# EAGLE design raspberry-pi-interface-board (EAGLE 6.3)
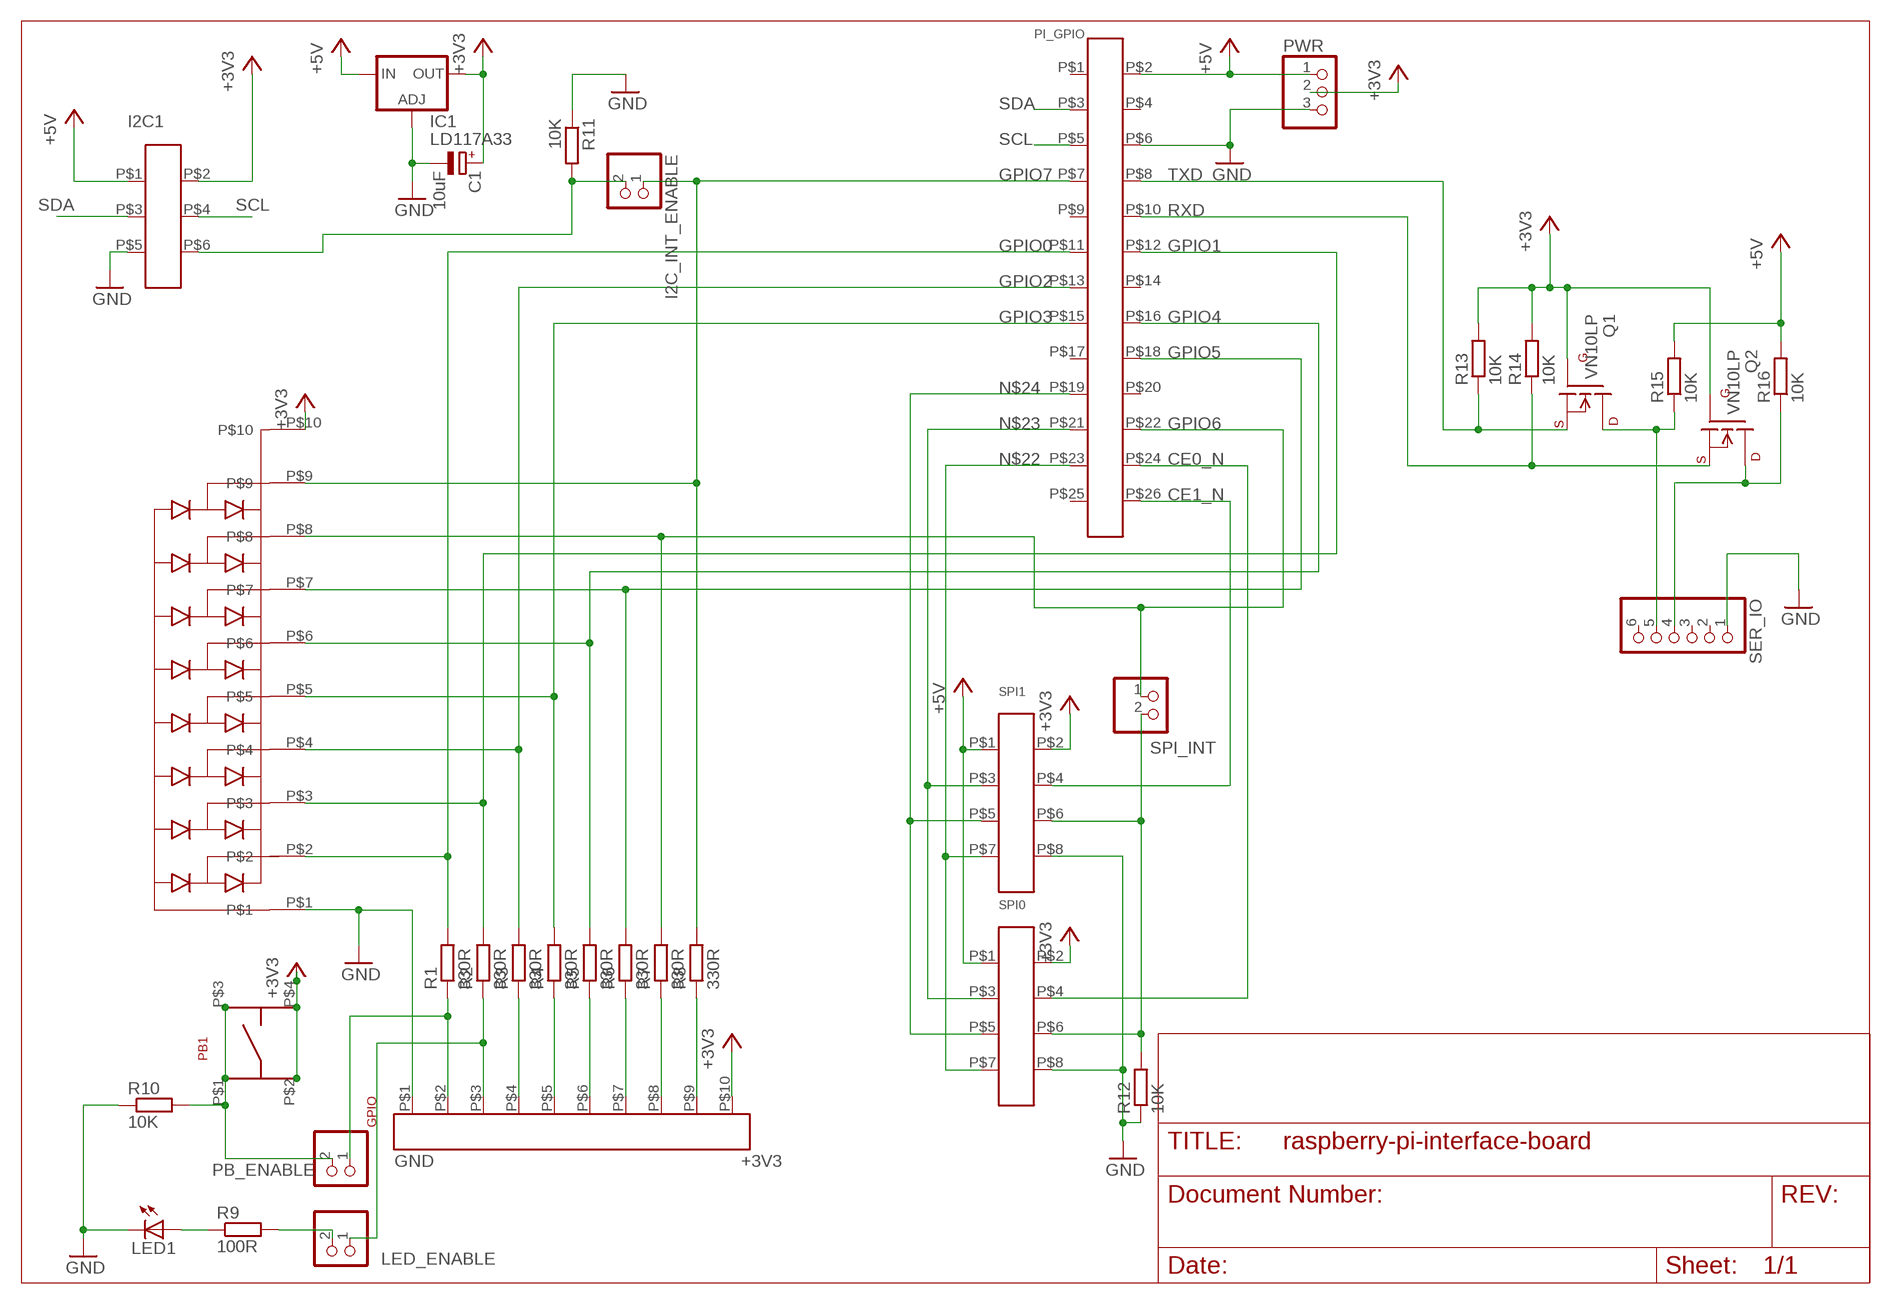
[diagram p0: schematic, sheet 1]

## Parts
C1  10uF  CPOL-EUE2.5-7  [E2,5-7]
GPIO  APM-10W-SOCKET  [AMP-10W-SOCKET]
I2C1  IC2_0  IDC-6W  [IDC-6W]
I2C_INT_ENABLE  PINHD-1X2  [1X02]
IC1  LD117A33  [TO220S]
LED1  LED3MM  [LED3MM]
LED_ENABLE  PINHD-1X2  [1X02]
PB1  TYCO-PUSHBUTTON  [TYCO-PUSHBUTTON]
PB_ENABLE  PINHD-1X2  [1X02]
PI_GPIO  IDC-26W  [IDC-26W]
PWR  PINHD-1X3  [1X03]
Q1  VN10LP  [TO92]
Q2  VN10LP  [TO92]
R1  330R  R-EU_0204/7  [0204/7]
R2  330R  R-EU_0204/7  [0204/7]
R3  330R  R-EU_0204/7  [0204/7]
R4  330R  R-EU_0204/7  [0204/7]
R5  330R  R-EU_0204/7  [0204/7]
R6  330R  R-EU_0204/7  [0204/7]
R7  330R  R-EU_0204/7  [0204/7]
R8  330R  R-EU_0204/7  [0204/7]
R9  100R  R-EU_0207/10  [0207/10]
R10  10K  R-EU_0207/10  [0207/10]
R11  10K  R-EU_0207/10  [0207/10]
R12  10K  R-EU_0207/10  [0207/10]
R13  10K  R-EU_0207/10  [0207/10]
R14  10K  R-EU_0207/10  [0207/10]
R15  10K  R-EU_0207/10  [0207/10]
R16  10K  R-EU_0207/10  [0207/10]
SER_IO  PINHD-1X6  [1X06]
SPI0  IDC-8W  [IDC-8W]
SPI1  IDC-8W  [IDC-8W]
SPI_INT  PINHD-1X2  [1X02]
U$2  D10-5A  [D10-5A]

## Nets
+3V3 [power]: C1.+ GPIO.P$10 I2C1.P$2 IC1.2(OUT) PB1.P$2 PB1.P$4 PWR.2 Q1.2(G) Q2.2(G) R13.2 R14.2 SPI0.P$2 SPI1.P$2 U$2.P$10
+5V [power]: I2C1.P$1 IC1.3(IN) PI_GPIO.P$2 PWR.1 R15.2 R16.2 SPI0.P$1 SPI1.P$1
CE0_N: PI_GPIO.P$24 SPI0.P$4
CE1_N: PI_GPIO.P$26 SPI1.P$4
GND [power]: C1.- GPIO.P$1 I2C1.P$5 IC1.1(ADJ) LED1.K(C) PI_GPIO.P$6 PWR.3 R10.1 R11.1 R12.1 SER_IO.1 SPI0.P$8 SPI1.P$8 U$2.P$1
GPIO0: PI_GPIO.P$11 R1.2 U$2.P$2
GPIO1: PI_GPIO.P$12 R2.2 U$2.P$3
GPIO2: PI_GPIO.P$13 R3.2 U$2.P$4
GPIO3: PI_GPIO.P$15 R4.2 U$2.P$5
GPIO4: PI_GPIO.P$16 R5.2 U$2.P$6
GPIO5: PI_GPIO.P$18 R6.2 U$2.P$7
GPIO6: PI_GPIO.P$22 R7.2 SPI_INT.1 U$2.P$8
GPIO7: I2C_INT_ENABLE.1 PI_GPIO.P$7 R8.2 U$2.P$9
N$1: PB1.P$1 PB1.P$3 PB_ENABLE.2 R10.2
N$2: Q2.1(D) R16.1 SER_IO.4
N$3: GPIO.P$2 PB_ENABLE.1 R1.1
N$4: GPIO.P$3 LED_ENABLE.1 R2.1
N$5: GPIO.P$4 R3.1
N$6: GPIO.P$5 R4.1
N$7: GPIO.P$6 R5.1
N$8: GPIO.P$7 R6.1
N$9: GPIO.P$8 R7.1
N$10: GPIO.P$9 R8.1
N$12: Q1.1(D) R15.1 SER_IO.5
N$14: LED1.A R9.1
N$15: LED_ENABLE.2 R9.2
N$21: I2C1.P$6 I2C_INT_ENABLE.2 R11.2
N$22: PI_GPIO.P$23 SPI0.P$7 SPI1.P$7
N$23: PI_GPIO.P$21 SPI0.P$3 SPI1.P$3
N$24: PI_GPIO.P$19 SPI0.P$5 SPI1.P$5
N$28: R12.2 SPI0.P$6 SPI1.P$6 SPI_INT.2
RXD: PI_GPIO.P$10 Q2.3(S) R14.1
SCL: I2C1.P$4 PI_GPIO.P$5
SDA: I2C1.P$3 PI_GPIO.P$3
TXD: PI_GPIO.P$8 Q1.3(S) R13.1
Unconnected: PI_GPIO.P$1 PI_GPIO.P$4 PI_GPIO.P$9 PI_GPIO.P$14 PI_GPIO.P$17 PI_GPIO.P$20 PI_GPIO.P$25 SER_IO.2 SER_IO.3 SER_IO.6

## Library data of the parts
C1 = rcl:CPOL-EU: POLARIZED CAPACITOR, European symbol
GPIO = quick2wire:APM-10W-SOCKET
I2C1 = quick2wire:IDC-6W: 6 Way IDC Connector
I2C_INT_ENABLE LED_ENABLE PB_ENABLE SPI_INT = pinhead:PINHD-1X2: PIN HEADER
IC1 = quick2wire:LD117A?*: Low drop fixed and adjustable positive voltage regulators 1 A Source: http://www.st.com/stonline/products/literature/ds/7194/ld1117axx.pdf
LED1 = adafruit:LED: LED OSRAM: - CHIPLED LG R971, LG N971, LY N971, LG Q971, LY Q971, LO R971, LY R971 LH N974, LH R974 LS Q976, LO Q976, LY Q976 LO Q996 - Hyper CHIPLED LW Q18S LB Q993, LB Q99A, LB R99A - SideLED LS A670, LO A670, LY A670, LG A670, LP A670 LB A673, LV A673, LT A673, LW A673 LH A674 LY A675 LS A676, LA A676, LO A676, LY A676, LW A676 LS A679, LY A679, LG A679 - Hyper Micro SIDELED® LS Y876, LA Y876, LO Y876, LY Y876 LT Y87S - SmartLED LW L88C, LW L88S LB L89C, LB L89S, LG L890 LS L89K, LO L89K, LY L89K LS L896, LA L896, LO L896, LY L896 - TOPLED LS T670, LO T670, LY T670, LG T670, LP T670 LSG T670, LSP T670, LSY T670, LOP T670, LYG T670 LG T671, LOG T671, LSG T671 LB T673, LV T673, LT T673, LW T673 LH T674 LS T676, LA T676, LO T676, LY T676, LB T676, LH T676, LSB T676, LW T676 LB T67C, LV T67C, LT T67C, LS T67K, LO T67K, LY T67K, LW E67C LS E67B, LA E67B, LO E67B, LY E67B, LB E67C, LV E67C, LT E67C LW T67C LS T679, LY T679, LG T679 LS T770, LO T770, LY T770, LG T770, LP T770 LB T773, LV T773, LT T773, LW T773 LH T774 LS E675, LA E675, LY E675, LS T675 LS T776, LA T776, LO T776, LY T776, LB T776 LHGB T686 LT T68C, LB T68C - Hyper Mini TOPLED® LB M676 - Mini TOPLED Santana® LG M470 LS M47K, LO M47K, LY M47K Source: http://www.osram.convergy.de/
PB1 = quick2wire:TYCO-PUSHBUTTON
PI_GPIO = quick2wire:IDC-26W
PWR = adafruit:PINHD-1X3: PIN HEADER
Q1 Q2 = quick2wire:VN10LP
R1-R16 = rcl:R-EU_: RESISTOR, European symbol
SER_IO = adafruit:PINHD-1X6: PIN HEADER
SPI0 SPI1 = quick2wire:IDC-8W
U$2 = quick2wire:D10-5A

## Net classes
0 default: width 0.254 mm
1 power: width 0.8 mm

## Board
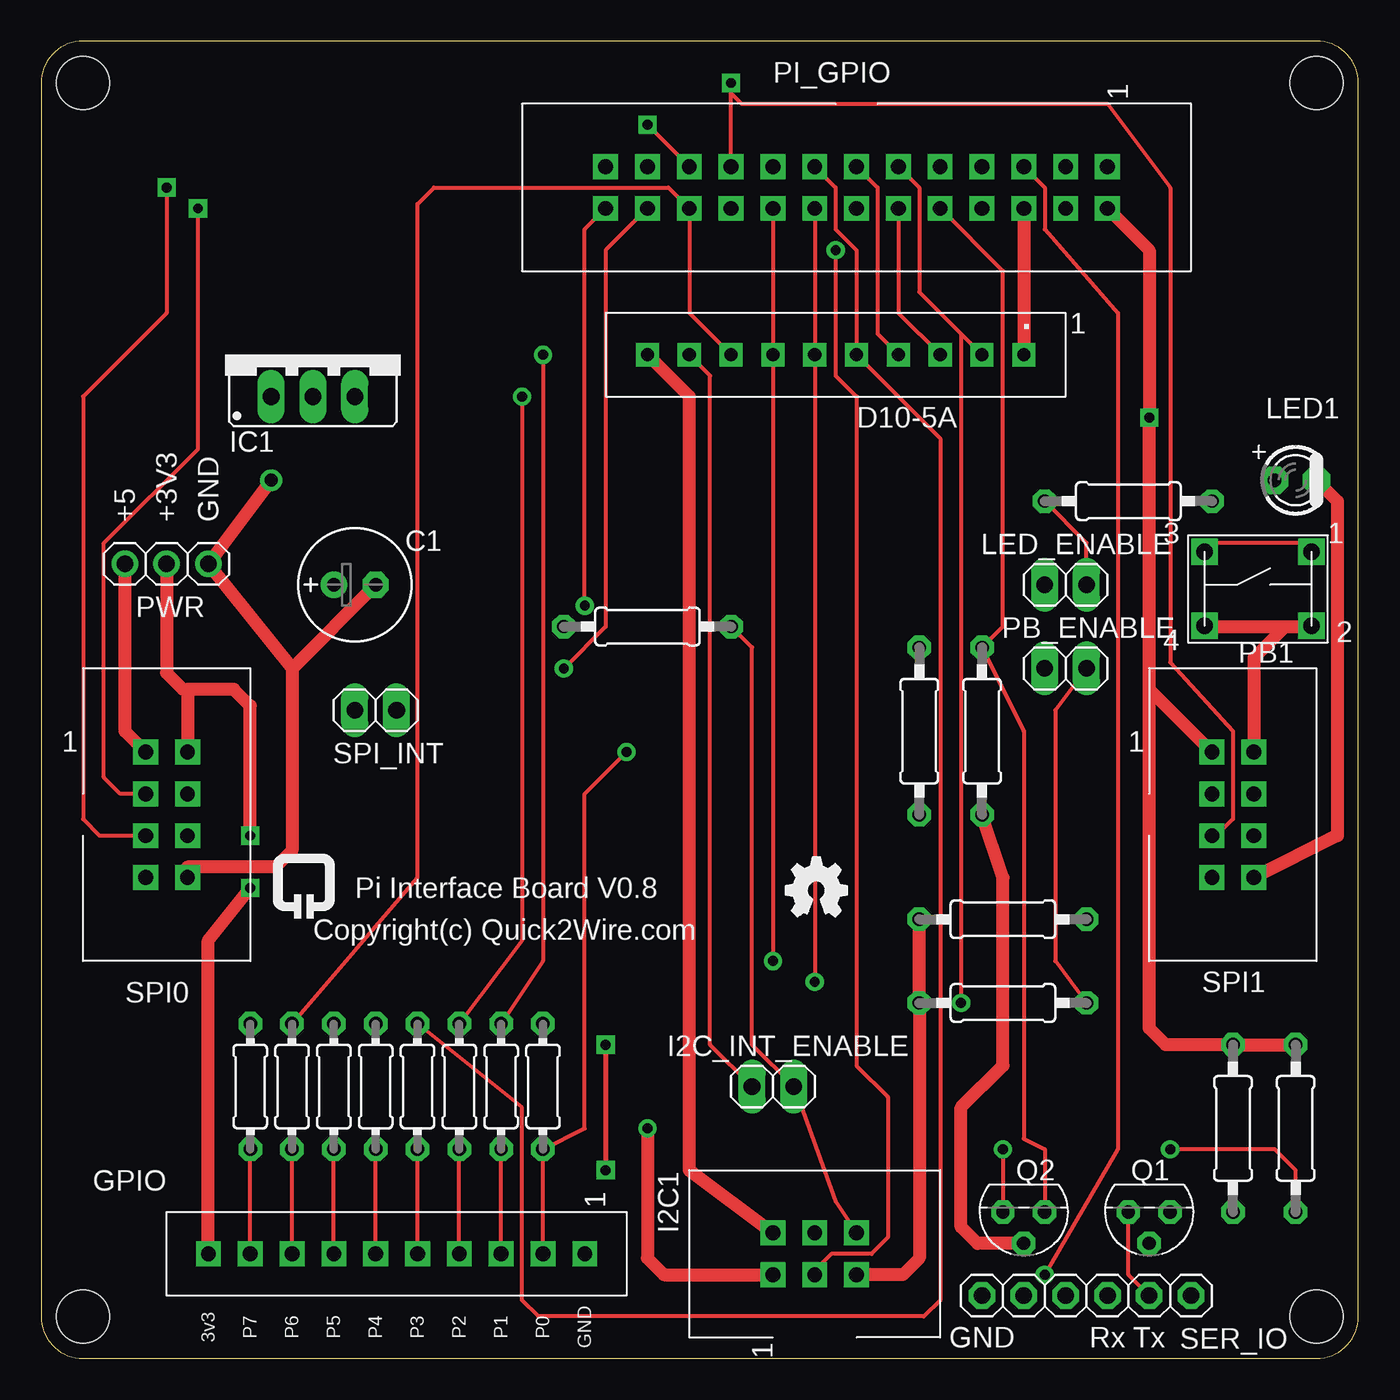
[diagram p1: board, top side]
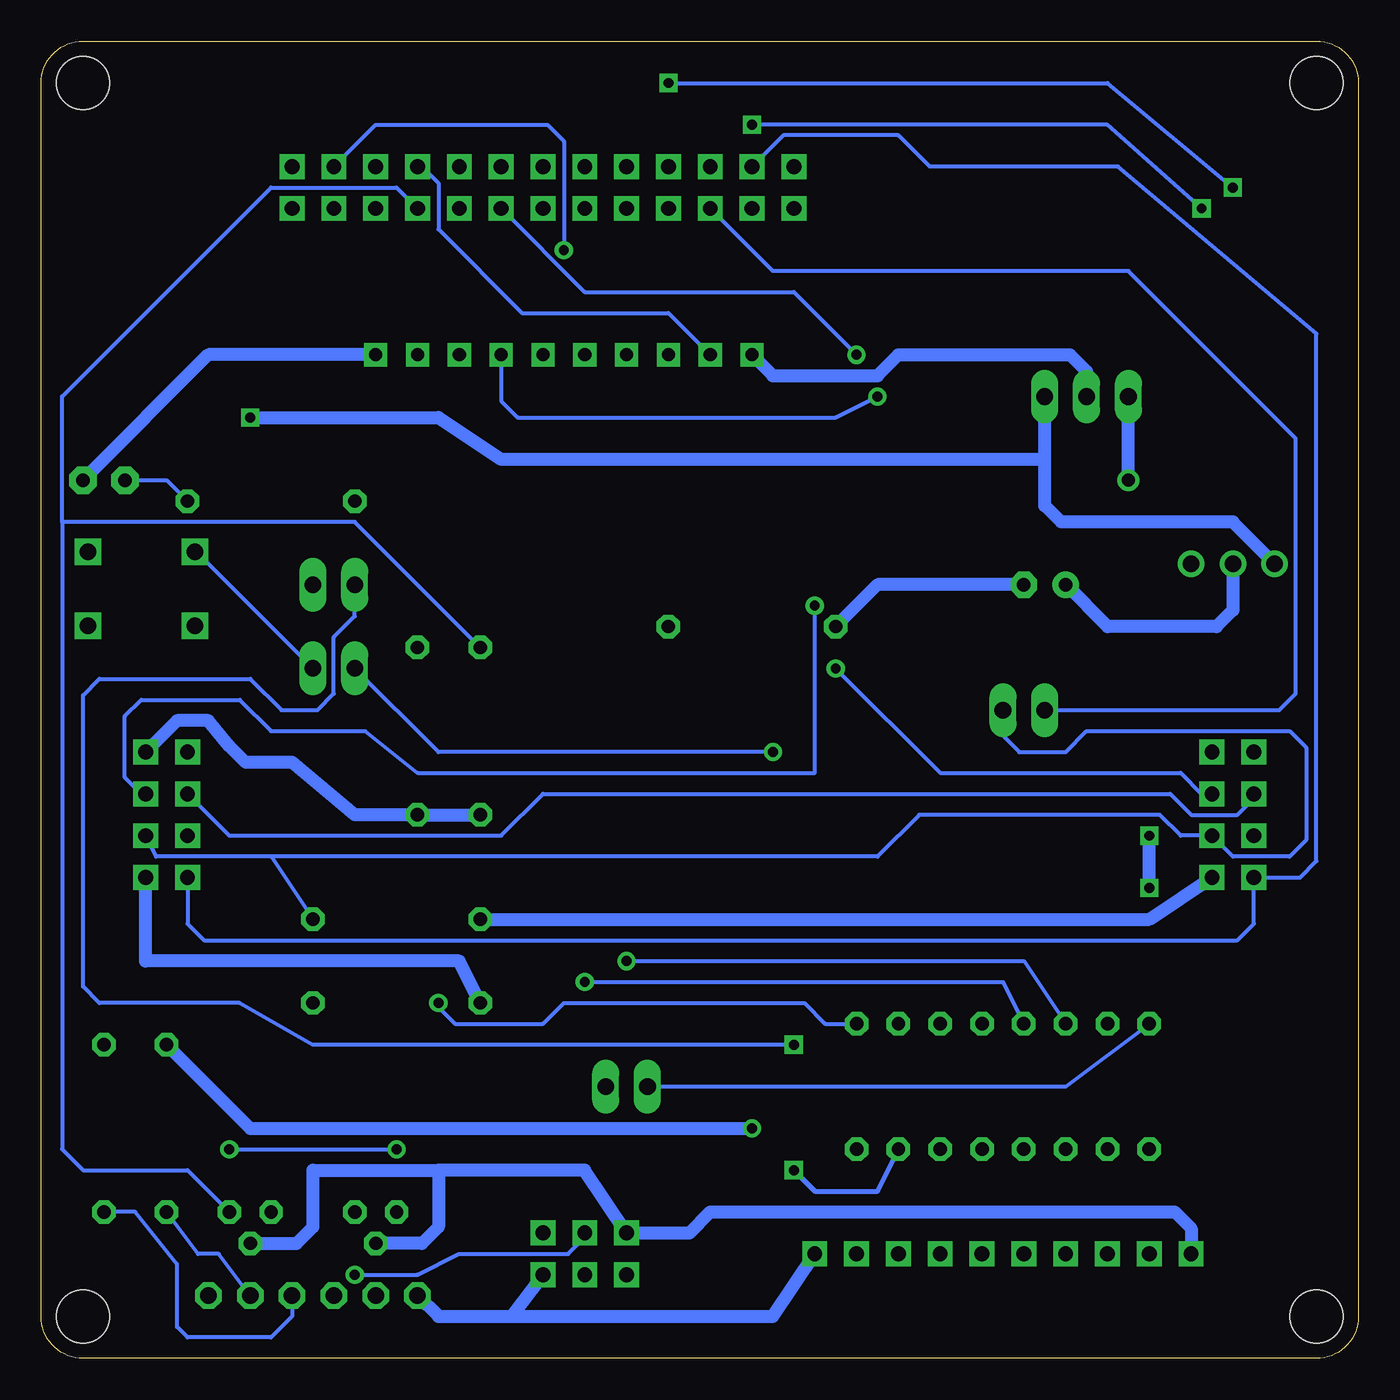
[diagram p2: board, bottom side, seen from below]

Size 80.01 x 80.01 mm. Coordinates in mm from the lower left corner, seen from the top.
Outline: 0,77.47 0,2.54 arc90 2.54,0 77.47,0 arc90 80.01,2.54 80.01,77.47 arc90 77.47,80.01 2.54,80.01 arc90 0,77.47
Copper layers (1*16): Top 0.035mm / dielectric 1.5mm / Bottom 0.035mm
Design rules "SparkFun": minimum track width 8mil, minimum drill 20mil, track to track 8mil, track to pad 8mil, pad to pad 8mil, via to via 8mil, smd to smd 8mil, copper to edge 10mil, drill to drill 8mil, minimum pad ring 12mil, minimum via ring 10mil, stop-mask expansion 4mil, vias tented up to drill 25mil, thermal gap 10mil
Holes 3.2 mm at 2.54,77.47 77.47,77.47 77.47,2.54 2.54,2.54
tRestrict: area 11.4,61 to 21.6,73.7

### Footprints (pad centres in the part's own frame; a part is rotated, then mirrored left to right if it is on the bottom)
E2,5-7 = drill 0.813 pad 1.6: + -1.27,0 | drill 0.813 pad 1.6 octagon: - 1.27,0
AMP-10W-SOCKET = drill 0.9 square: P$1 0,11.43; P$2 0,8.89; P$3 0,6.35; P$4 0,3.81; P$5 0,1.27; P$6 0,-1.27; P$7 0,-3.81; P$8 0,-6.35; P$9 0,-8.89; P$10 0,-11.43
IDC-6W = drill 0.9 square: P$1 -1.27,2.54; P$2 1.27,2.54; P$3 -1.27,0; P$4 1.27,0; P$5 -1.27,-2.54; P$6 1.27,-2.54
1X02 = drill 1.016 long: 1 -1.27,0; 2 1.27,0
TO220S = drill 1.016 long: 1 -2.54,-2.54; 2 0,-2.54; 3 2.54,-2.54
LED3MM = drill 0.813 pad 1.676 octagon: A -1.27,0; K 1.27,0
TYCO-PUSHBUTTON = drill 1 square: P$1 3.5,2; P$2 3.5,-2.5; P$3 -3,2; P$4 -3,-2.5
IDC-26W = drill 0.9 square: P$1 -1.27,0; P$2 1.27,0; P$3 -1.27,-2.54; P$4 1.27,-2.54; P$5 -1.27,-5.08; P$6 1.27,-5.08; P$7 -1.27,-7.62; P$8 1.27,-7.62; P$9 -1.27,-10.16; P$10 1.27,-10.16; P$11 -1.27,-12.7; P$12 1.27,-12.7; P$13 -1.27,-15.24; P$14 1.27,-15.24; P$15 -1.27,-17.78; P$16 1.27,-17.78; P$17 -1.27,-20.32; P$18 1.27,-20.32; P$19 -1.27,-22.86; P$20 1.27,-22.86; P$21 -1.27,-25.4; P$22 1.27,-25.4; P$23 -1.27,-27.94; P$24 1.27,-27.94; P$25 -1.27,-30.48; P$26 1.27,-30.48
1X03 = drill 1: 1 -2.54,0; 2 0,0; 3 2.54,0
TO92 = drill 0.813 octagon: 1 1.27,0; 2 0,1.905; 3 -1.27,0
0204/7 = drill 0.813 octagon: 1 -3.81,0; 2 3.81,0
0207/10 = drill 0.813 octagon: 1 -5.08,0; 2 5.08,0
1X06 = drill 1 octagon: 1 -6.35,0; 2 -3.81,0; 3 -1.27,0; 4 1.27,0; 5 3.81,0; 6 6.35,0
IDC-8W = drill 0.9 square: P$1 -1.27,3.81; P$2 1.27,3.81; P$3 -1.27,1.27; P$4 1.27,1.27; P$5 -1.27,-1.27; P$6 1.27,-1.27; P$7 -1.27,-3.81; P$8 1.27,-3.81
D10-5A = drill 0.8 square: P$1 -10.16,0; P$2 -7.62,0; P$3 -5.08,0; P$4 -2.54,0; P$5 0,0; P$6 2.54,0; P$7 5.08,0; P$8 7.62,0; P$9 10.16,0; P$10 12.7,0

### Placement (x,y rotation side)
C1  19.05,46.99 0 top
GPIO  21.59,6.35 270 top
I2C1  46.99,6.35 90 top
I2C_INT_ENABLE  44.45,16.51 0 top
IC1  16.51,60.96 0 top
LED1  76.2,53.34 0 top
LED_ENABLE  62.23,46.99 0 top
PB1  73.66,46.99 0 top
PB_ENABLE  62.23,41.91 0 top
PI_GPIO  64.77,71.12 270 top
PWR  7.62,48.26 0 top
Q1  67.31,8.89 180 top
Q2  59.69,8.89 180 top
R1  30.48,16.51 90 top
R2  27.94,16.51 90 top
R3  25.4,16.51 90 top
R4  22.86,16.51 90 top
R5  20.32,16.51 90 top
R6  17.78,16.51 90 top
R7  15.24,16.51 90 top
R8  12.7,16.51 90 top
R9  66.04,52.07 180 top
R10  58.42,21.59 0 top
R11  36.83,44.45 0 top
R12  58.42,26.67 0 top
R13  53.34,38.1 270 top
R14  57.15,38.1 270 top
R15  72.39,13.97 90 top
R16  76.2,13.97 90 top
SER_IO  63.5,3.81 0 top
SPI0  7.62,33.02 0 top
SPI1  72.39,33.02 0 top
SPI_INT  20.32,39.37 0 top
U$1  [OSHWLOGO_TOL_0.2]  -15.24,60.96 0 top  (outside the outline)
U$2  49.53,60.96 180 top
U$5  [QUICK2WIRE-LOGO]  13.97,26.67 0 top
U$6  [OSHW-LOGO]  45.09,26.67 0 top

### Tracks (layer width: path | path; a pad name or v marks a point on that pad's centre or on a via)
+3V3  (via drill 0.6)
  Top 0.8: 75.56,44.45 73.66,42.55 SPI1.P$2 | 75.56,44.45 71.12,44.45 PB1.P$4 | 75.56,44.45 77.47,44.45 PB1.P$2 | R14.2 58.42,29.21 58.42,17.78 55.88,15.24 55.88,7.99 56.88,6.99 Q2.2 | PWR.2 7.62,41.64 8.62,40.64 8.89,40.64 | U$2.P$10 39.37,58.42 39.37,11.43 I2C1.P$2 | v12.7,31.75 12.7,39.64 11.7,40.64 8.89,40.64 | 8.89,40.64 SPI0.P$2 | v12.7,28.57 10.16,25.4 GPIO.P$10
  Bottom 0.8: R13.2 R14.2 60.96,33.02 64.77,36.2 67.58,36.2 68.58,37.2 69.85,38.73 71.75,38.73 SPI1.P$2 | 55.88,11.43 63.5,11.43 63.5,7.99 64.5,6.99 Q1.2 | C1.+ 15.24,44.45 8.62,44.45 7.62,45.45 PWR.2 | GPIO.P$10 10.16,7.89 11.16,8.89 39.37,8.89 40.64,7.62 I2C1.P$2 46.99,11.43 55.88,11.43 | 55.88,11.43 55.88,7.99 56.88,6.99 Q2.2 | IC1.2 16.51,59.96 17.51,60.96 27.94,60.96 29.21,59.69 35.56,59.69 U$2.P$10 | v12.7,28.57 v12.7,31.75
+5V  (via drill 0.6)
  Top 0.8: PWR.1 5.08,38.1 SPI0.P$1 | v36.83,13.97 36.83,6.08 37.83,5.08 I2C1.P$1 | 67.31,40.64 67.31,20.05 68.31,19.05 R15.2 R16.2 | 67.31,40.64 v67.31,57.15 67.31,67.31 PI_GPIO.P$2 | SPI1.P$1 67.31,40.64
  Bottom 0.8: 19.05,54.61 19.05,51.8 18.05,50.8 7.62,50.8 PWR.1 | v36.83,13.97 67.31,13.97 R15.2 | v67.31,57.15 55.88,57.15 52.07,54.61 19.05,54.61 | 19.05,54.61 IC1.3
CE0_N  (via drill 0.6)
  Top 0.254: v31.75,41.91 34.29,44.45 34.29,67.31 PI_GPIO.P$24
  Bottom 0.254: SPI0.P$4 9.53,34.29 10.79,35.56 25.4,35.56 v31.75,41.91
CE1_N  (via drill 0.6)
  Top 0.254: PI_GPIO.P$26 33.02,68.58 v33.02,45.72
  Bottom 0.254: v33.02,45.72 33.02,35.56 57.15,35.56 60.33,38.1 66.04,38.1 67.94,40.01 73.93,40.01 74.93,39.01 74.93,35.29 73.93,34.29 SPI1.P$4
GND  (via drill 0.8)
  Top 0.8: 15.24,41.91 15.24,30.84 14.24,29.84 8.89,29.84 SPI0.P$8 | 15.24,41.91 PWR.3 v13.97,53.34 | 15.24,41.91 C1.- | R12.1 R10.1 53.34,6.08 52.34,5.08 I2C1.P$5 | PI_GPIO.P$6 U$2.P$1 | SPI1.P$8 78.74,31.75 78.74,52.07 LED1.K
  Bottom 0.8: R11.1 29.21,46.99 C1.- | 51.44,2.54 I2C1.P$5 | SER_IO.1 55.88,2.54 51.44,2.54 | GPIO.P$1 35.56,2.54 51.44,2.54 | SPI1.P$8 73.66,24.13 54.61,24.13 R10.1 | LED1.K 69.85,60.96 U$2.P$1 | SPI0.P$8 12.7,26.67 R12.1 | v13.97,53.34 IC1.1
GPIO0  (via drill 0.6)
  Top 0.254: 55.88,62.23 53.34,64.77 53.34,71.12 PI_GPIO.P$11 | 55.88,62.23 U$2.P$2 | 55.88,62.23 v55.88,21.59
  Bottom 0.254: v55.88,21.59 55.88,21.32 54.88,20.32 49.53,20.32 48.26,21.59 33.66,21.59 32.38,20.32 R1.2
GPIO1  (via drill 0.6)
  Top 0.254: U$2.P$3 52.07,63.5 PI_GPIO.P$12 | R2.2 30.48,24.13 v30.48,60.96
  Bottom 0.254: v30.48,60.96 34.29,64.77 46.99,64.77 PI_GPIO.P$12
GPIO2  (via drill 0.6)
  Top 0.254: U$2.P$4 50.8,62.23 50.8,71.12 PI_GPIO.P$13 | R3.2 29.21,25.4 v29.21,58.42
  Bottom 0.254: v29.21,58.42 31.75,57.15 51.07,57.15 52.07,58.15 U$2.P$4
GPIO3
  Top 0.254: PI_GPIO.P$15 48.26,71.12 48.26,68.58 49.53,67.31 U$2.P$5 54.61,55.88 54.61,3.54 53.61,2.54 30.21,2.54 29.21,3.54 29.21,15.24 R4.2
GPIO4  (via drill 0.6)
  Top 0.254: PI_GPIO.P$16 U$2.P$6 v46.99,22.86
  Bottom 0.254: R5.2 21.59,22.86 v46.99,22.86
GPIO5  (via drill 0.6)
  Top 0.254: PI_GPIO.P$18 U$2.P$7 v44.45,24.13
  Bottom 0.254: R6.2 20.32,24.13 v44.45,24.13
GPIO6
  Top 0.254: U$2.P$8 39.37,63.5 PI_GPIO.P$22 38.1,71.12 23.86,71.12 22.86,70.12 22.86,29.21 R7.2
  Bottom 0.254: PI_GPIO.P$22 35.56,66.04 13.97,66.04 3.81,55.88 3.81,40.37 4.81,39.37 SPI_INT.1
GPIO7
  Top 0.254: U$2.P$9 40.64,59.69 40.64,19.05 I2C_INT_ENABLE.1
  Bottom 0.254: U$2.P$9 41.91,63.5 50.8,63.5 55.88,68.58 55.88,71.39 56.88,72.39 PI_GPIO.P$7 | R8.2 17.78,16.51 I2C_INT_ENABLE.1
N$1
  Top 0.254: PB1.P$3 71.12,49.53 76.83,49.53 PB1.P$1 | R10.2 61.59,24.13 61.59,39.37 PB_ENABLE.2
  Bottom 0.254: PB_ENABLE.2 71.12,49.53 PB1.P$3
N$2  (via drill 0.6)
  Top 0.254: v58.42,12.7 Q2.1 | v68.58,12.7 74.93,12.7 76.2,11.43 R16.1
  Bottom 0.254: SER_IO.4 64.77,2.54 66.04,1.27 71.12,1.27 71.75,1.91 71.75,5.71 74.3,8.89 R16.1 | v68.58,12.7 v58.42,12.7
N$3  (via drill 0.6)
  Top 0.254: GPIO.P$2 R1.1 33.02,13.97 33.02,34.29 v35.56,36.83
  Bottom 0.254: PB_ENABLE.1 55.88,36.83 v35.56,36.83
N$4  (via drill 0.6)
  Top 0.254: GPIO.P$3 R2.1
  Top 0.305: v34.29,19.05 v34.29,11.43
  Bottom 0.254: LED_ENABLE.1 60.96,45.09 62.23,43.81 62.23,40.37 63.23,39.37 65.41,39.37 67.31,41.27 76.47,41.27 77.47,40.27 77.47,22.59 76.47,21.59 67.94,21.59 63.5,19.05 v34.29,19.05
  Bottom 0.305: v34.29,11.43 33.02,10.16 29.21,10.16 R2.1
N$5
  Top 0.254: GPIO.P$4 R3.1
N$6
  Top 0.254: GPIO.P$5 R4.1
N$7
  Top 0.254: GPIO.P$6 R5.1
N$8
  Top 0.254: GPIO.P$7 R6.1
N$9
  Top 0.254: GPIO.P$8 R7.1
N$10
  Top 0.254: GPIO.P$9 R8.1
N$12
  Top 0.254: Q1.1 66.04,5.08 SER_IO.5
  Bottom 0.254: R15.1 70.48,6.35 69.22,6.35 SER_IO.5
N$14
  Bottom 0.254: R9.1 72.39,53.34 LED1.A
N$15
  Top 0.254: R9.2 63.5,49.53 LED_ENABLE.2
N$21
  Top 0.254: I2C1.P$6 48.26,9.53 I2C_INT_ENABLE.2 43.18,19.05 43.18,43.18 R11.2
N$22
  Bottom 0.254: SPI1.P$7 71.12,26.4 70.12,25.4 7.35,25.4 6.35,26.4 SPI0.P$7 3.54,29.21 2.54,30.21 2.54,62.23 14.61,72.39 26.04,72.39 27.94,74.3 34.92,74.3 PI_GPIO.P$23
N$23  (via drill 0.6)
  Top 0.254: v36.83,74.93 PI_GPIO.P$21 | v9.53,69.85 9.53,55.24 3.81,49.53 3.81,35.29 4.81,34.29 SPI0.P$3
  Bottom 0.254: SPI0.P$3 6.35,34.02 7.35,33.02 10.16,33.02 11.43,34.29 49.53,34.29 52.07,31.75 68.58,31.75 SPI1.P$3 | v36.83,74.93 15.24,74.93 v9.53,69.85
N$24  (via drill 0.6)
  Top 0.254: SPI0.P$5 3.54,31.75 2.54,32.75 2.54,58.42 7.62,63.5 v7.62,71.12 | PI_GPIO.P$19 v41.91,77.47 41.91,76.83 42.55,76.2 64.77,76.2 68.58,71.12 68.58,42.27 72.39,38.1 72.39,32.75 71.39,31.75 SPI1.P$5
  Bottom 0.254: v7.62,71.12 15.24,77.47 v41.91,77.47
N$28
  Bottom 0.254: SPI1.P$6 73.03,30.48 66.04,30.48 | SPI_INT.2 21.59,37.83 20.59,36.83 17.78,36.83 16.51,38.1 4.17,38.1 3.17,37.1 3.17,31.48 4.17,30.48 7.62,30.48 SPI0.P$6 10.79,31.75 12.06,33.02 26.67,33.02 29.21,30.48 66.04,30.48 | 66.04,30.48 R12.2
RXD
  Top 0.254: PI_GPIO.P$10 58.42,66.04 58.42,44.45 R14.1 59.69,38.1 59.69,13.34 60.96,12.7 Q2.3
SCL  (via drill 0.6)
  Top 0.254: v60.96,5.08 65.41,12.7 65.41,63.5 60.96,68.58 60.96,71.12 PI_GPIO.P$5
  Bottom 0.254: I2C1.P$4 46.99,7.35 47.99,6.35 54.61,6.35 57.15,5.08 v60.96,5.08
SDA  (via drill 0.6)
  Top 0.254: I2C1.P$3 46.99,5.35 47.99,6.35 50.44,6.35 51.44,7.35 51.44,15.88 49.53,17.78 49.53,58.42 48.26,59.69 v48.26,67.31
  Bottom 0.254: v48.26,67.31 48.26,73.93 49.26,74.93 59.69,74.93 PI_GPIO.P$3
TXD
  Bottom 0.254: PI_GPIO.P$8 58.42,71.12 66.04,71.12 78.74,58.42 78.74,50.8 | 78.74,50.8 60.96,50.8 R13.1 | Q1.3 71.12,11.43 77.47,11.43 78.74,12.7 78.74,50.8

### Text on the board
tPlace: . | GND | Pi Interface Board V0.8 | Copyright(c) Quick2Wire.com | 3v3 | P7 | P6 | P5 | P4 | P3 | P2 | P1 | P0 | GND
tNames: D10-5A | +5 | +3V3 | GND | Rx | Tx